# EasyEDA Pro project ProPrj_AUDIO CONTROLER_2026-01-01.epro, board PCB4
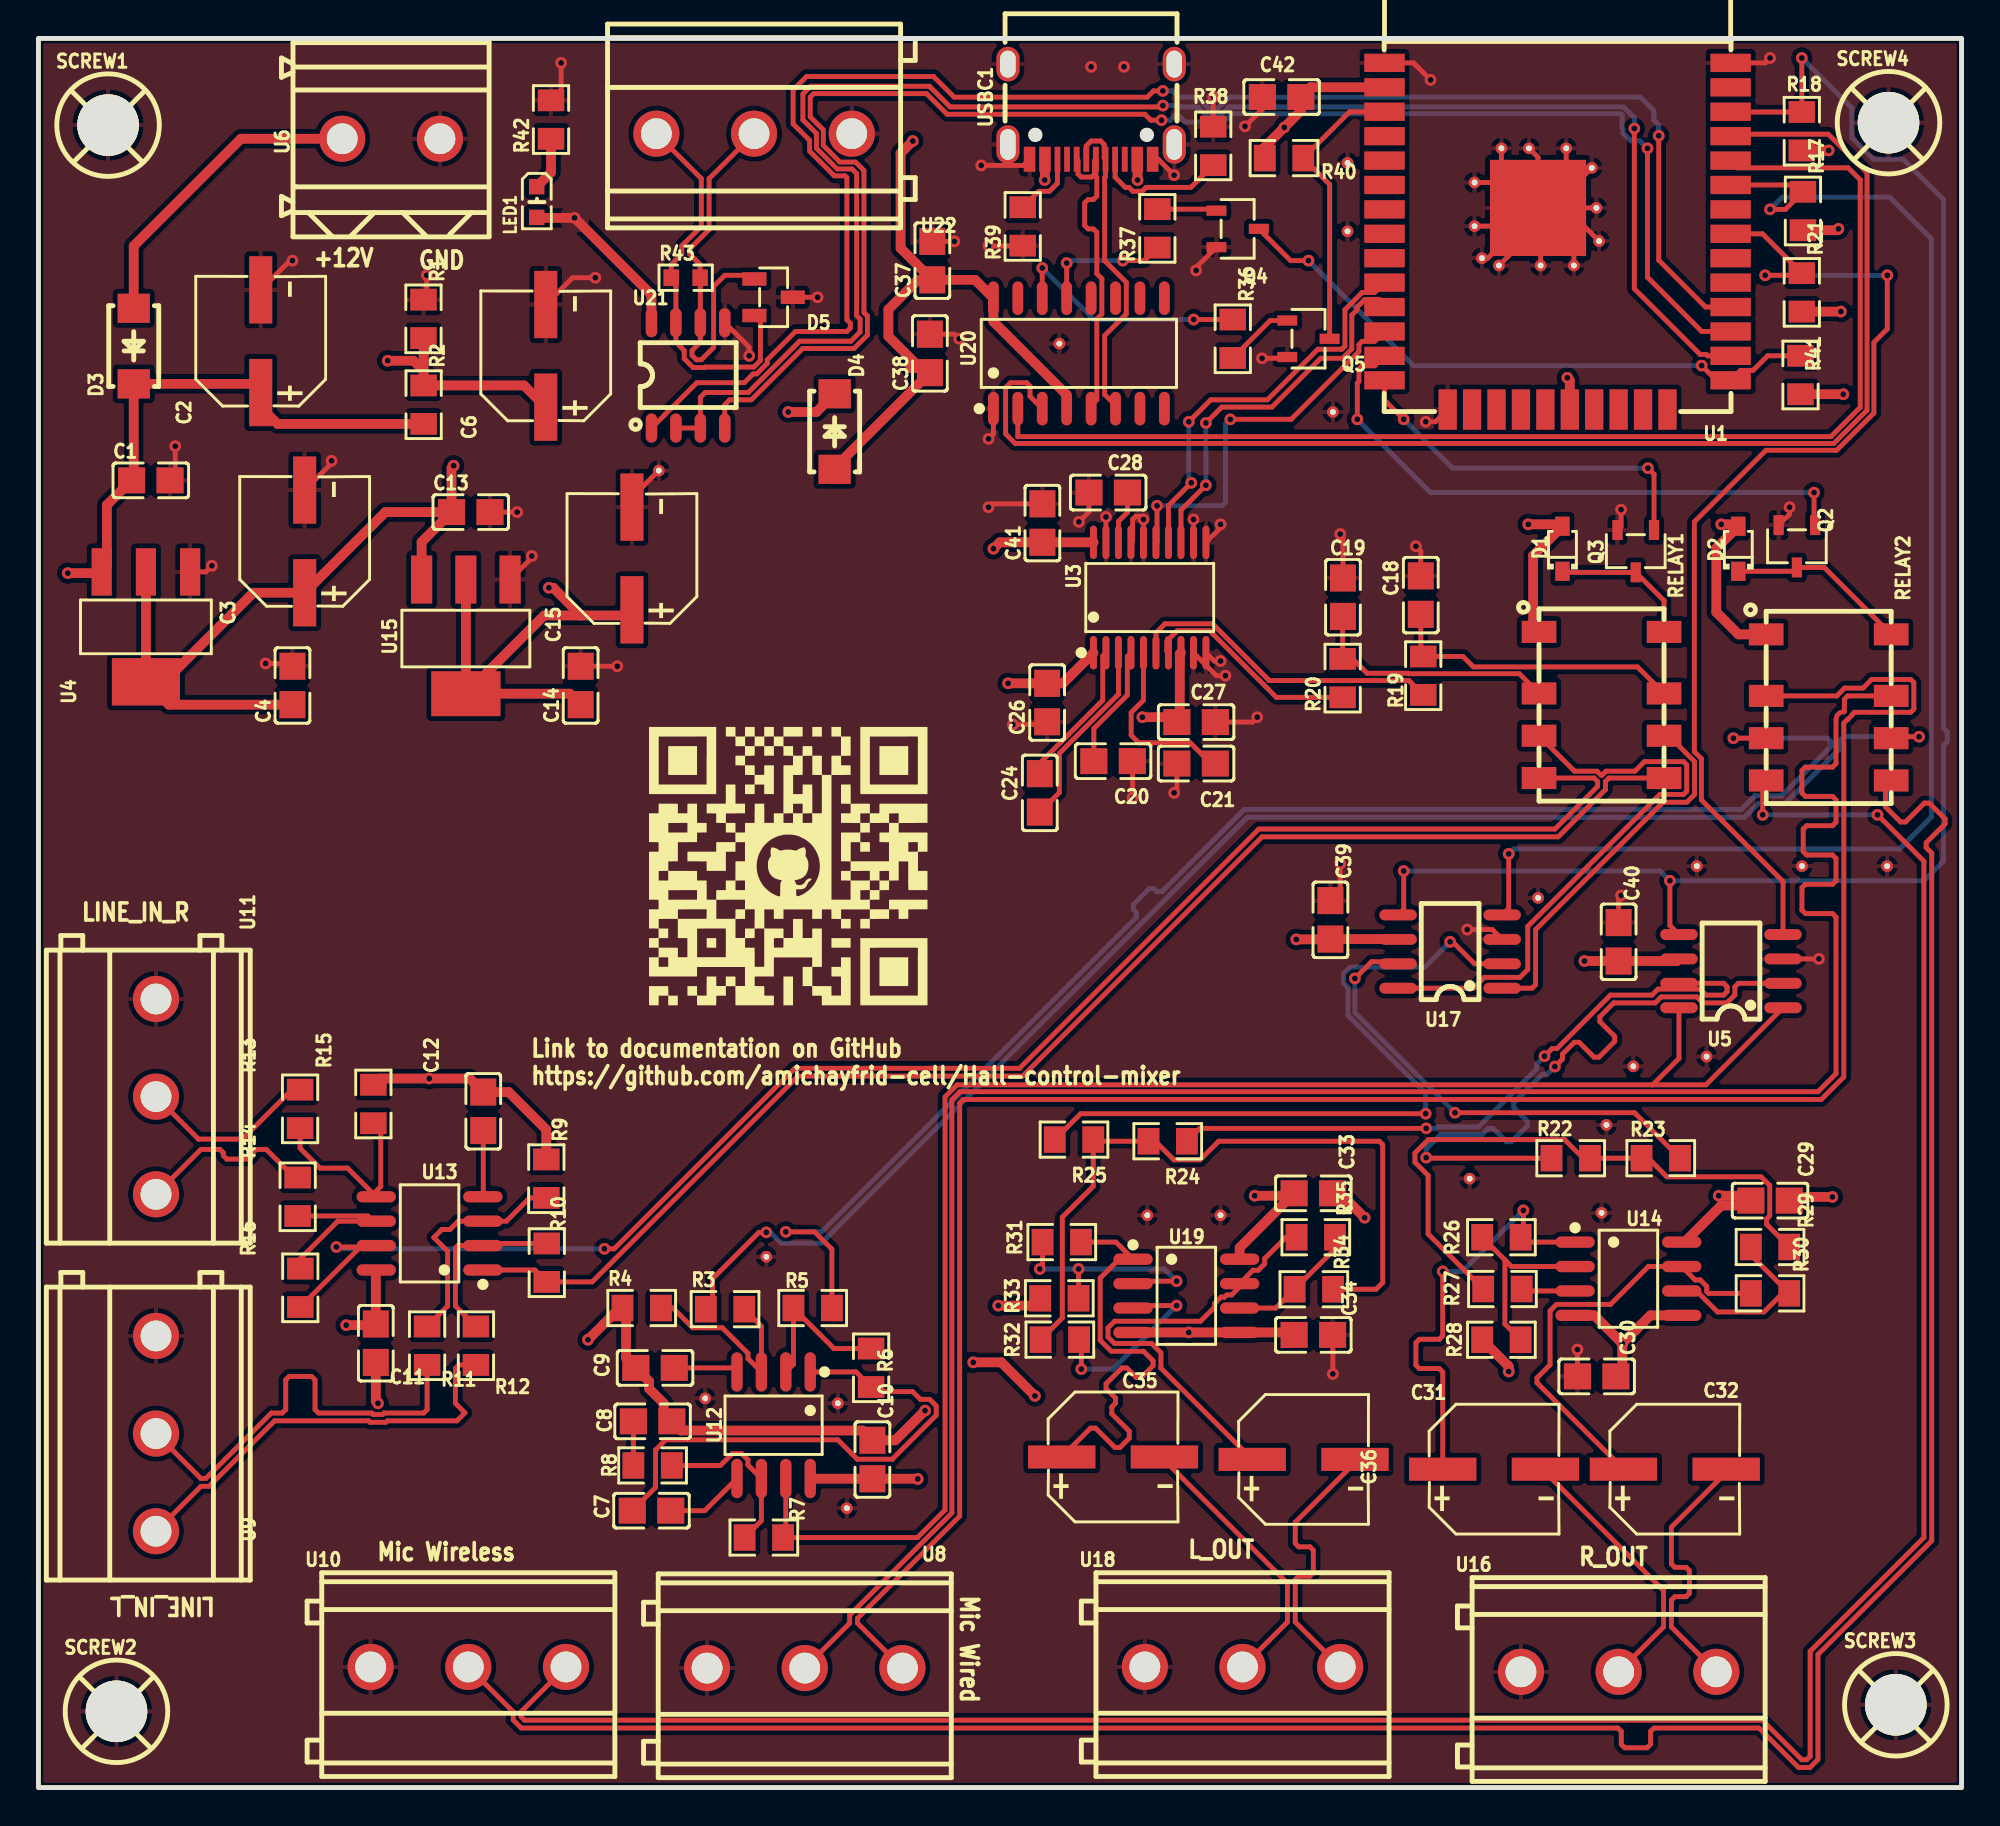
[diagram p1: board, top side]
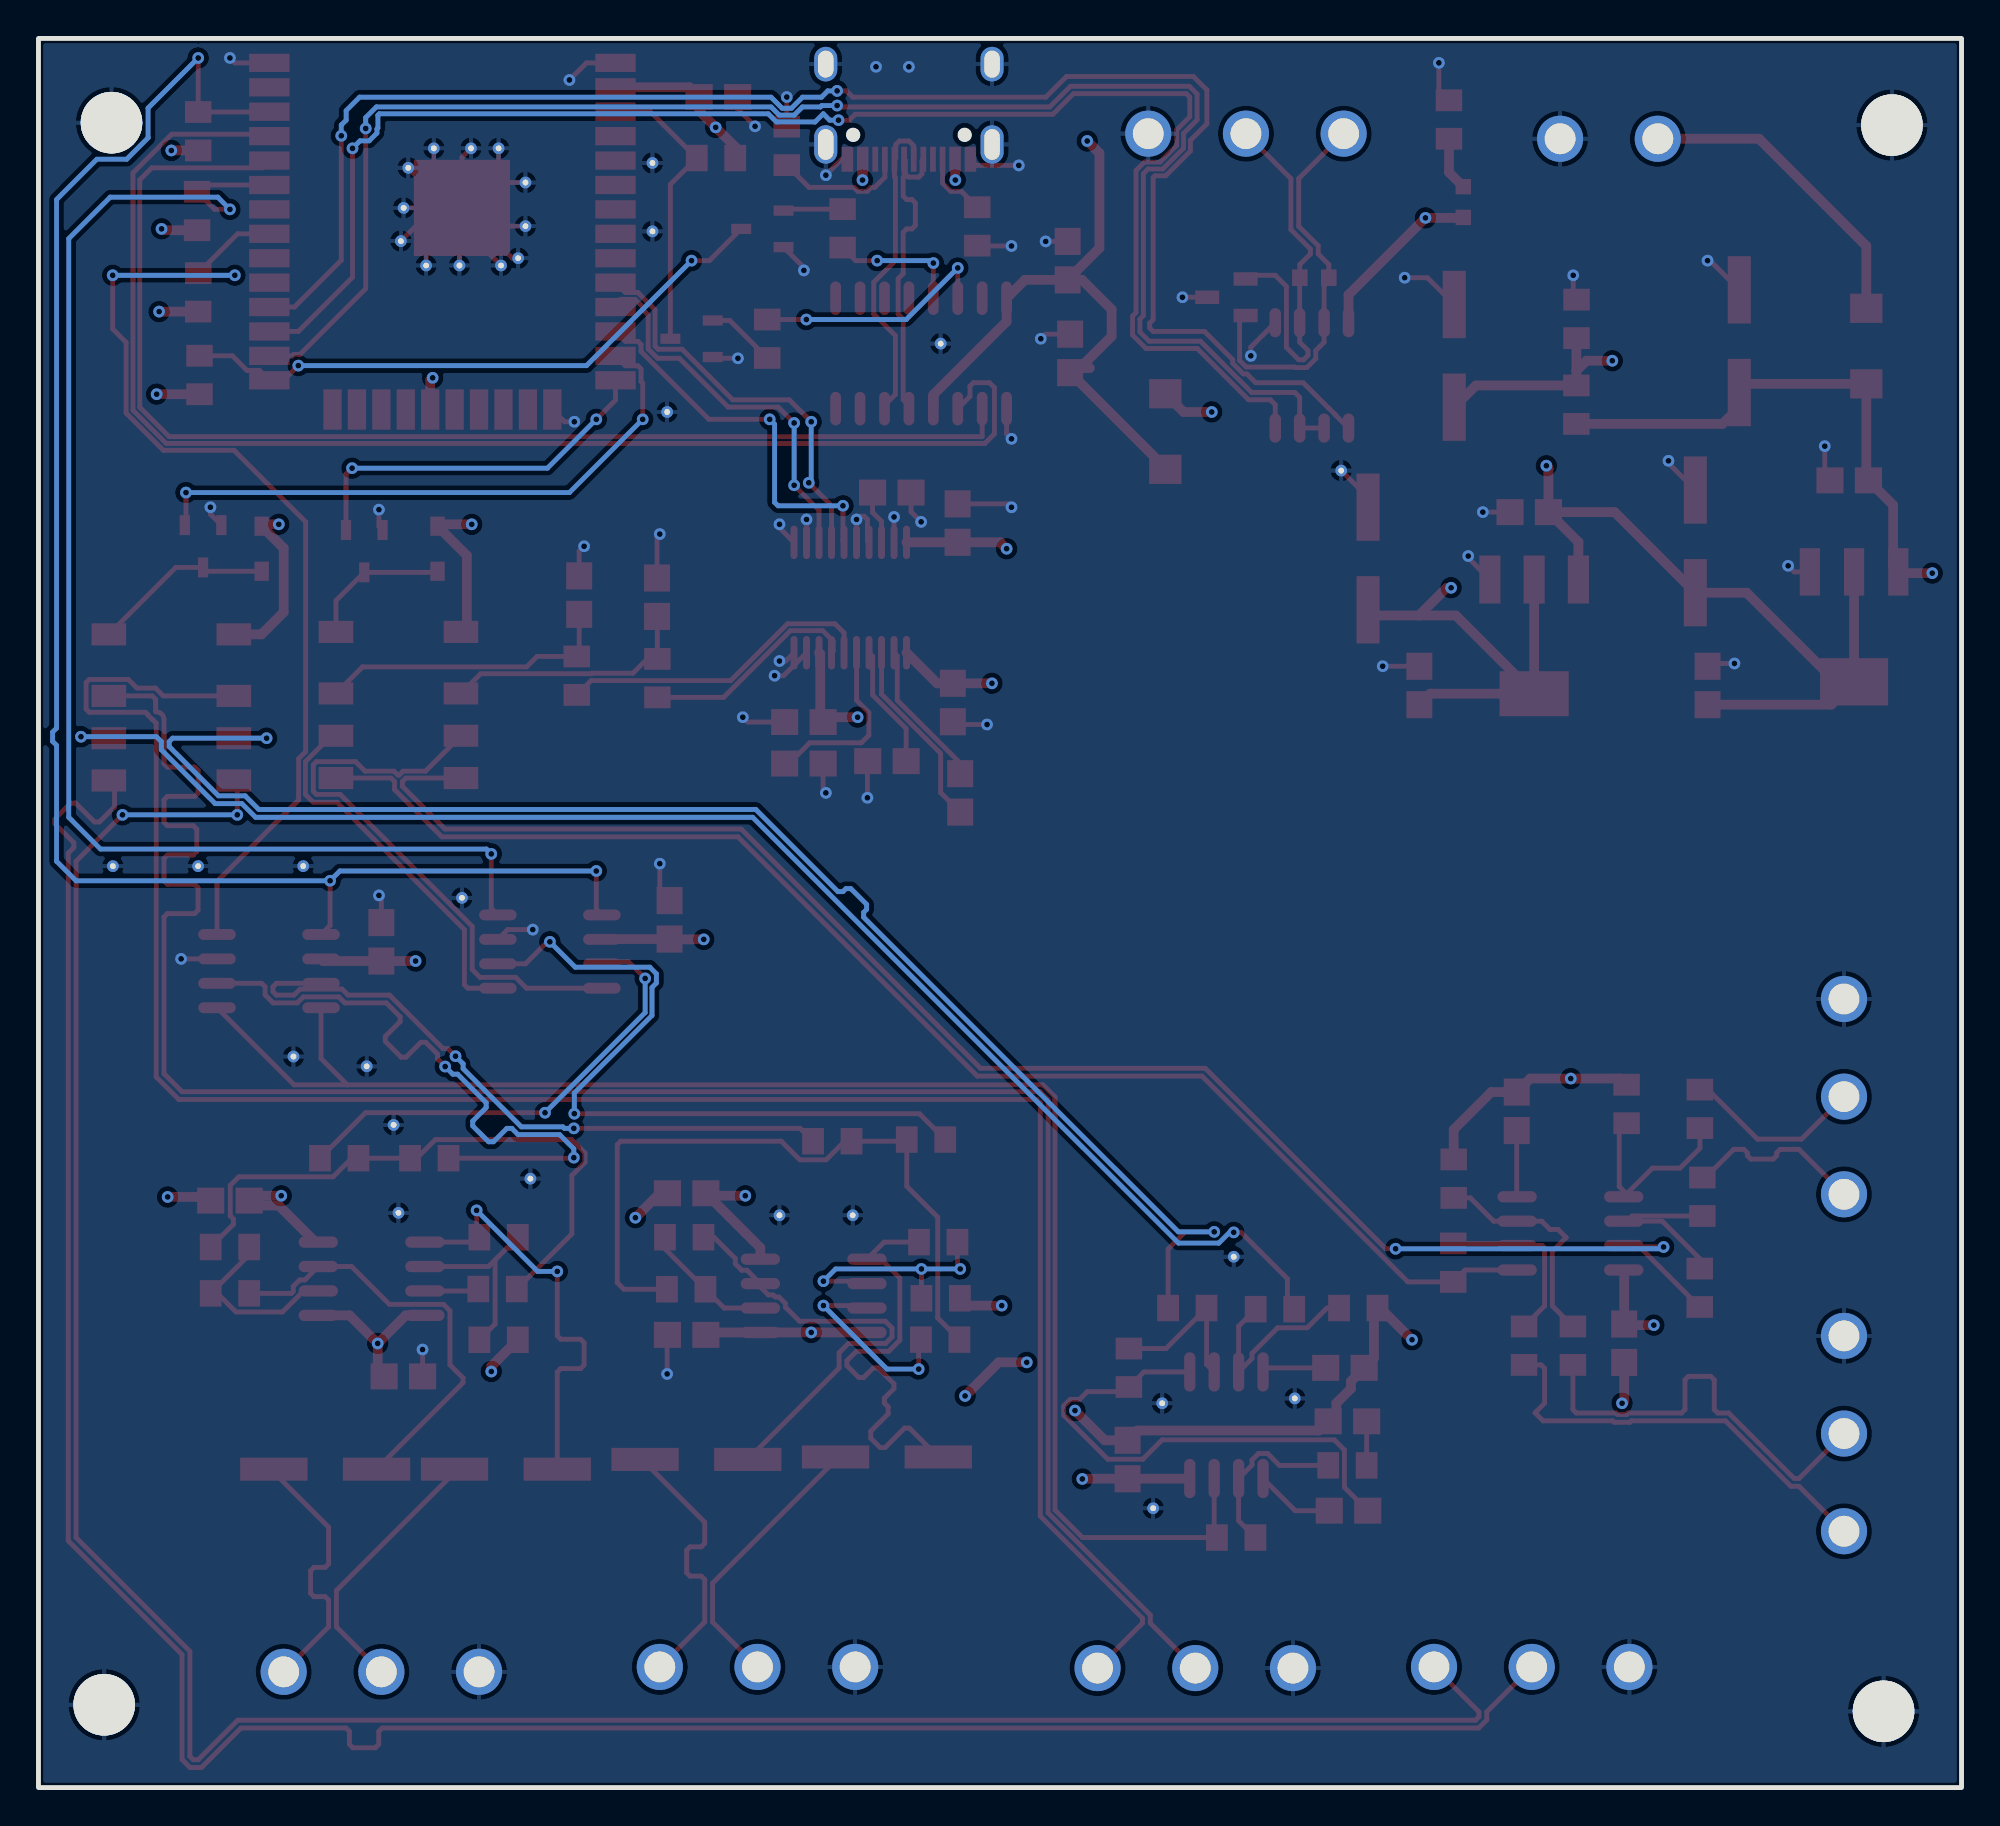
[diagram p2: board, bottom side, seen from below]

Outline 100 x 90.98 mm; copper layers: Top Layer, GND, Inner2, Bottom Layer. Coordinates in mm from the lower left corner of the outline.
Outline path: rectangle 0,90.98 100,0
Stack: Top Layer 0.035mm Outer layer thickness 1oz / Dielectric1 0.2104mm 7628 RC49% 8.6mil / GND 0.0152mm Inner layer thickness / Dielectric2 1.065mm 1.1mm H/HOZ Copper / Inner2 0.0152mm Inner layer thickness / Dielectric3 0.2104mm 7628 RC49% 8.6mil / Bottom Layer 0.035mm Outer layer thickness 1oz

## Design rules (mm)
net XLR_OUT_R_HOT: DP2
net $1N12984: DP3
net XLR_OUT_R_COLD: DP2
net $1N13611: DP5
net XLR_OUT_L_HOT: DP4
net $1N13634: DP5
net XLR_OUT_L_COLD: DP4
net $1N5833: DP12
net $1N6045: DP11
net $1N6056: DP11
net LINE_IN_L: DP14
net $1N6041: DP8
net $1N6052: DP8
net $1N6309: DP10
net $1N6179: DP9
net $1N6300: DP10
net $1N6296: DP9
net LINE_IN_R: DP14
net MIC_VOL_OUT_R: DP13
net MIC_VOL_OUT_L: DP13
net MIX_L_MUSIC: DP15
net MIX_R_MUSIC: DP15
net $1N5727: DP6
net $1N5749: DP7
net $1N5761: DP6
net USB_DP: DP1
net USB_DN: DP1
net $1N40597: DP12
net $1N40603: DP7
net C31: DP3
net B: DP17
net A: DP17
template: JLCPCB Capability(Two Layers Board)
spacing copperThickness1oz (default): track to track 0.102, other pairs 0.152 to 0.3
spacing copperThickness2oz: track to track 0.203, other pairs 0.152 to 0.3
track width copperThickness1oz (default): min 0.127, default 0.254, max 2.54
track width copperThickness2oz: min 0.203, default 0.254, max 2.54
differential pair differentialPair (default): width min 0.127, default 0.254, max 2.54; gap min 0.152, default 0.152
via viaSize (default): diameter min 0.5, default 0.61, max 10; hole min 0.3, default 0.305, max 6.3

## Placement (name value [footprint] x y rotation side)
C1  100nF  [C0805]  5.84 68 0 top
C2  47uF  [CAP-SMD_BD6.3-L6.6-W6.6-LS7.6-FD]  11.56 75.23 90 top
C3  47uF  [CAP-SMD_BD6.3-L6.6-W6.6-LS7.6-FD]  13.84 64.82 90 top
C4  100nF  [C0805]  13.21 57.33 90 top
C6  47uF  [CAP-SMD_BD6.3-L6.6-W6.6-LS7.6-FD]  26.38 74.47 90 top
C7  10uF  [C0805]  31.88 14.4 0 top
C8  10uF  [C0805]  31.94 19.05 0 top
C9  100nF  [C0805]  32.06 21.83 0 top
C10  100nF  [C0805]  43.37 17.06 270 top
C11  100nF  [C0805]  17.54 23.11 90 top
C12  100nF  [C0805]  23.13 35.18 90 top
C13  100nF  [C0805]  22.48 66.34 0 top
C14  100nF  [C0805]  28.19 57.33 90 top
C15  47uF  [CAP-SMD_BD6.3-L6.6-W6.6-LS7.6-FD]  30.86 63.93 90 top
C18  100nF  [C0805]  71.88 62.03 270 top
C19  100nF  [C0805]  67.83 61.92 270 top
C20  100nF  [C0805]  55.88 53.39 180 top
C21  100nF  [C0805]  60.2 53.26 0 top
C24  100nF  [C0805]  52.07 51.74 90 top
C26  100nF  [C0805]  52.45 56.44 270 top
C27  100nF  [C0805]  60.2 55.42 180 top
C28  10uF  [C0805]  55.63 67.36 180 top
C29  100nF  [C0805]  90.04 30.53 0 top
C30  100nF  [C0805]  81.03 21.39 0 top
C31  47uF  [CAP-SMD_BD6.3-L6.6-W6.6-LS7.6-FD]  75.69 16.56 0 top
C32  47uF  [CAP-SMD_BD6.3-L6.6-W6.6-LS7.6-FD]  85.09 16.56 0 top
C33  100nF  [C0805]  66.29 30.91 0 top
C34  100nF  [C0805]  66.29 23.55 180 top
C35  47uF  [CAP-SMD_BD6.3-L6.6-W6.6-LS7.6-FD]  55.88 17.2 0 top
C36  47uF  [CAP-SMD_BD6.3-L6.6-W6.6-LS7.6-FD]  65.79 17.07 0 top
C37  100nF  [C0805]  46.48 79.43 90 top
C38  100nF  [C0805]  46.36 74.6 90 top
C39  100nF  [C0805]  67.18 45.14 270 top
C40  100nF  [C0805]  82.17 43.99 270 top
C41  10uF  [C0805]  52.2 65.77 90 top
C42  10uF  [C0805]  64.64 87.94 180 top
D1  1N4148WS  [SOD-323_L1.8-W1.3-LS2.5-RD]  79.25 64.44 90 top
D2  1N4148WS  [SOD-323_L1.8-W1.3-LS2.5-RD]  88.39 64.44 90 top
D3  SS14  [SMA_L4.2-W2.6-LS5.0-RD_1]  4.95 74.98 90 top
D4  SS14  [SMA_L4.2-W2.6-LS5.0-RD_1]  41.4 70.54 270 top
D5  SM712  [SOT-23-3_L2.9-W1.3-P1.90-LS2.4-BR]  38.23 77.52 180 top
LED1  KT-0603W  [LED0603-R-RD_WHITE]  25.91 82.47 270 top
NOREF  -  [Pad_e1952]  68.07 84.51 0 top
NOREF#2  -  [Pad_e2417]  67.31 71.55 0 top
NOREF#3  -  [Pad_e1957]  34.67 20.24 0 top
NOREF#4  -  [Pad_e1945]  74.42 31.67 0 top
NOREF#5  -  [Pad_e1072]  75.06 79.55 0 top
NOREF#6  -  [Pad_e1949]  77.98 46.28 0 top
NOREF#7  -  [Pad_e1485]  96.13 47.93 0 top
NOREF#8  -  [Pad_e1060]  77.51 85.27 0 top
NOREF#9  -  [Pad_e1062]  75.95 79.17 0 top
NOREF#10  -  [Pad_e1484]  91.7 47.93 0 top
NOREF#11  -  [Pad_e1063]  78.11 79.17 0 top
NOREF#12  -  [Pad_e821]  32.26 68.5 0 top
NOREF#13  -  [Pad_e1030]  76.07 85.27 0 top
NOREF#14  -  [Pad_e1947]  82.93 37.52 0 top
NOREF#15  -  [Pad_e1950]  53.09 75.11 0 top
NOREF#16  -  [Pad_e1942]  61.47 29.77 0 top
NOREF#17  -  [Pad_e1064]  79.84 79.17 0 top
NOREF#18  -  [Pad_e1958]  37.85 27.61 0 top
NOREF#19  -  [Pad_e1943]  57.66 29.77 0 top
NOREF#20  -  [Pad_e1065]  81.01 82.17 0 top
NOREF#21  -  [Pad_e1951]  68.07 80.95 0 top
NOREF#22  -  [Pad_e1061]  79.44 85.27 0 top
NOREF#23  -  [Pad_e1946]  81.53 34.47 0 top
NOREF#24  -  [Pad_e1941]  81.28 29.9 0 top
NOREF#25  -  [Pad_e1070]  74.68 83.49 0 top
NOREF#26  -  [Pad_e1071]  74.68 81.22 0 top
NOREF#27  -  [Pad_e1948]  86.74 38.02 0 top
NOREF#28  -  [Pad_e1956]  41.57 19.99 0 top
NOREF#29  -  [Pad_e1955]  42.04 14.53 0 top
NOREF#30  -  [Pad_e1483]  86.23 47.93 0 top
NOREF#31  -  [Pad_e1069]  80.77 84.25 0 top
NOREF#32  -  [Pad_e1066]  81.15 80.44 0 top
Q2  MMBT3904  [SOT-23-3_L3.0-W1.7-P0.95-LS2.9-BR]  91.44 64.57 90 top
Q3  MMBT3904  [SOT-23-3_L3.0-W1.7-P0.95-LS2.9-BR]  83.06 64.31 90 top
Q4  S8050 J3Y(RANGE:200-350)  [SOT-23-3_L3.0-W1.7-P0.95-LS2.9-BR]  62.36 81.08 180 top
Q5  S8050 J3Y(RANGE:200-350)  [SOT-23-3_L3.0-W1.7-P0.95-LS2.9-BR]  66.04 75.36 180 top
R1  10kΩ  [R0805]  20.02 76.4 270 top
R2  10kΩ  [R0805]  20.03 71.93 270 top
R3  10kΩ  [R0805]  35.7 24.88 0 top
R4  10kΩ  [R0805]  31.37 24.94 0 top
R5  10kΩ  [R0805]  40.26 24.94 180 top
R6  10kΩ  [R0805]  43.3 21.84 90 top
R7  100kΩ  [R0805]  37.72 13 0 top
R8  4.7kΩ  [R0805]  31.94 16.76 180 top
R9  10kΩ  [R0805]  26.41 31.67 270 top
R10  10kΩ  [R0805]  26.43 27.3 90 top
R11  10kΩ  [R0805]  20.21 22.98 90 top
R12  10kΩ  [R0805]  22.75 22.98 90 top
R13  10kΩ  [R0805]  13.61 35.3 270 top
R14  10kΩ  [R0805]  13.48 30.73 270 top
R15  10kΩ  [R0805]  17.42 35.56 90 top
R16  10kΩ  [R0805]  13.61 26 90 top
R17  4.7kΩ  [R0805]  91.75 82.01 270 top
R18  4.7kΩ  [R0805]  91.69 86.16 270 top
R19  470Ω  [R0805]  72.01 57.84 90 top
R20  470Ω  [R0805]  67.82 57.71 90 top
R21  4.7kΩ  [R0805]  91.69 77.77 270 top
R22  4.7kΩ  [R0805]  79.68 32.74 0 top
R23  4.7kΩ  [R0805]  84.36 32.74 180 top
R24  4.7kΩ  [R0805]  58.72 33.62 180 top
R25  4.7kΩ  [R0805]  53.85 33.71 180 top
R26  10kΩ  [R0805]  76.07 28.63 0 top
R27  10kΩ  [R0805]  76.13 25.93 0 top
R28  10kΩ  [R0805]  76.07 23.29 0 top
R29  10kΩ  [R0805]  90.04 28.12 180 top
R30  10kΩ  [R0805]  90.04 25.7 180 top
R31  10kΩ  [R0805]  53.21 28.37 0 top
R32  10kΩ  [R0805]  53.11 23.3 0 top
R33  10kΩ  [R0805]  53.09 25.45 0 top
R34  10kΩ  [R0805]  66.32 25.92 180 top
R35  10kΩ  [R0805]  66.42 28.63 180 top
R36  1kΩ  [R0805]  62.1 75.36 270 top
R37  1kΩ  [R0805]  58.18 81.1 90 top
R38  4.7kΩ  [R0805]  61.09 85.39 270 top
R39  4.7kΩ  [R0805]  51.18 81.2 90 top
R40  10kΩ  [R0805]  64.77 84.76 180 top
R41  10kΩ  [R0805]  91.63 73.48 90 top
R42  1kΩ  [R0805]  26.65 86.76 90 top
R43  120Ω  [R0603]  33.65 78.54 0 top
RELAY1  MUSIC_RELAY  [RELAY-SMD_HFD4-5-SR]  81.28 56.31 270 top
RELAY2  MIC RELAY  [RELAY-SMD_HFD4-5-SR]  93.09 56.18 270 top
SCREW1  -  [Screw-Hole-M3]  3.68 86.41 0 top
SCREW2  -  [Screw-Hole-M3]  4.12 3.9 0 top
SCREW3  -  [Screw-Hole-M3]  96.65 4.24 0 top
SCREW4  -  [Screw-Hole-M3]  96.27 86.54 0 top
U1  ESP32-WROOM-32D-N4  [WIFIM-SMD_39P-L25.5-W18.0-P1.27-BL]  78.99 80.7 270 top
U3  BT_DAC  [TSSOP-20_L6.5-W4.4-P0.65-LS6.4-BL]  57.79 61.9 0 top
U4  5V  [SOT-223_L6.5-W3.5-P2.30-LS7.0-BR]  5.59 60.38 90 top
U5  MICֹ_VOL  [SOIC-8_L5.0-W4.0-P1.27-LS6.0-BL]  88.01 42.47 90 top
U6  POWER_IN  [CONN-TH_2P-P5.08_DB128L-5.08-2P]  18.34 85.76 0 top
U8  Mic Wired  [CONN-TH_3P-P5.08_KF129-5.08-3P]  39.85 6.22 0 top
U9  LINEֹֹ_IN_L  [CONN-TH_3P-P5.08_KF129-5.08-3P]  6.11 18.41 270 top
U10  Mic Wireless  [CONN-TH_3P-P5.08_KF129-5.08-3P]  22.35 6.27 0 top
U11  LINE_IN_R  [CONN-TH_3P-P5.08_KF129-5.08-3P]  6.11 35.94 270 top
U12  MIC_AMP  [SOIC-8_L4.9-W3.9-P1.27-LS6.0-BL]  38.23 18.85 180 top
U13  LINEֹֹ_IN_L  [SOIC-8_L4.9-W3.9-P1.27-LS6.0-BL]  20.34 28.83 90 top
U14  OUT_R  [SOIC-8_L4.9-W3.9-P1.27-LS6.0-BL]  82.68 26.47 270 top
U15  3V  [SOT-223-3_L6.5-W3.4-P2.30-LS7.0-BR]  22.22 59.87 90 top
U16  R_OUT  [CONN-TH_3P-P5.08_KF129-5.08-3P]  82.17 6.02 0 top
U17  MUSIC_VOL  [SOIC-8_L5.0-W4.0-P1.27-LS6.0-BL]  73.41 43.48 90 top
U18  L_OUT  [CONN-TH_3P-P5.08_KF129-5.08-3P]  62.61 6.27 0 top
U19  OUT_L  [SOIC-8_L4.9-W3.9-P1.27-LS6.0-BL]  59.69 25.58 270 top
U20  USB  [SOP-16_L10.0-W3.9-P1.27-LS6.0-BL]  54.1 74.6 0 top
U21  SSP3485  [SOP-8_L5.0-W3.9-P1.27-LS6.0-BL]  33.78 73.46 0 top
U22  rs485  [CONN-TH_3P-P5.08_KF129-5.08-3P]  37.21 86.03 180 top
USBC1  TYPE-C-31-M-12  [USB-C_SMD-TYPE-C-31-M-12_1]  54.74 87.17 180 top

## Footprints (pads in the part's own frame, mm; a bottom-side part is the same pattern mirrored in y, then rotated)
C0805
  rect 1.41x1.35 smd: 1(-1,0) 2(1,0)
CAP-SMD_BD6.3-L6.6-W6.6-LS7.6-FD
  rect 3.5x1.2 smd: 1(-2.67,0) 2(2.67,0)
CONN-TH_2P-P5.08_DB128L-5.08-2P
  round 2.4 hole 1.6: 1(-2.54,0) 2(2.54,0)
CONN-TH_3P-P5.08_KF129-5.08-3P
  round 2.4 hole 1.6: 1(-5.08,0) 2(0,0) 3(5.08,0)
LED0603-R-RD_WHITE
  rect 0.8x0.8 smd: 1(0.8,0) 2(-0.8,0)
Pad_e821
  round 0.61 hole 0.305: 1(0,0)
Pad_e1030
  round 0.61 hole 0.305: 1(0,0)
Pad_e1060
  round 0.61 hole 0.305: 2(0,0)
Pad_e1061
  round 0.61 hole 0.305: 3(0,0)
Pad_e1062
  round 0.61 hole 0.305: 4(0,0)
Pad_e1063
  round 0.61 hole 0.305: 5(0,0)
Pad_e1064
  round 0.61 hole 0.305: 6(0,0)
Pad_e1065
  round 0.61 hole 0.305: 7(0,0)
Pad_e1066
  round 0.61 hole 0.305: 8(0,0)
Pad_e1069
  round 0.61 hole 0.305: 9(0,0)
Pad_e1070
  round 0.61 hole 0.305: 10(0,0)
Pad_e1071
  round 0.61 hole 0.305: 11(0,0)
Pad_e1072
  round 0.61 hole 0.305: 12(0,0)
Pad_e1483
  round 0.61 hole 0.305: 1(0,0)
Pad_e1484
  round 0.61 hole 0.305: 2(0,0)
Pad_e1485
  round 0.61 hole 0.305: 3(0,0)
Pad_e1941
  round 0.61 hole 0.305: 1(0,0)
Pad_e1942
  round 0.61 hole 0.305: 2(0,0)
Pad_e1943
  round 0.61 hole 0.305: 3(0,0)
Pad_e1945
  round 0.61 hole 0.305: 1(0,0)
Pad_e1946
  round 0.61 hole 0.305: 2(0,0)
Pad_e1947
  round 0.61 hole 0.305: 3(0,0)
Pad_e1948
  round 0.61 hole 0.305: 4(0,0)
Pad_e1949
  round 0.61 hole 0.305: 5(0,0)
Pad_e1950
  round 0.61 hole 0.305: 6(0,0)
Pad_e1951
  round 0.61 hole 0.305: 7(0,0)
Pad_e1952
  round 0.61 hole 0.305: 8(0,0)
Pad_e1955
  round 0.61 hole 0.305: 1(0,0)
Pad_e1956
  round 0.61 hole 0.305: 2(0,0)
Pad_e1957
  round 0.61 hole 0.305: 3(0,0)
Pad_e1958
  round 0.61 hole 0.305: 4(0,0)
Pad_e2417
  round 0.61 hole 0.305: 1(0,0)
R0603
  rect 0.806x0.864 smd: 1(-0.753,0) 2(0.753,0)
R0805
  rect 1.133x1.377 smd: 1(-1,0) 2(1,0)
RELAY-SMD_HFD4-5-SR
  rect 1.15x1.8 smd: 1(-3.8,-3.25) 2(-0.6,-3.25) 3(1.6,-3.25) 4(3.8,-3.25) 5(3.8,3.25) 6(1.6,3.25) 7(-0.6,3.25) 8(-3.8,3.25)
Screw-Hole-M3
  round 3.2 hole 3.2: 1(-0.064,0.064)
SMA_L4.2-W2.6-LS5.0-RD_1
  rect 1.52x1.68 smd: 1(-1.965,0) 2(1.965,0)
SOD-323_L1.8-W1.3-LS2.5-RD
  rect 1x0.75 smd: 1(-1.173,0) 2(1.173,0)
SOIC-8_L4.9-W3.9-P1.27-LS6.0-BL
  oval 0.588x2.045 smd: 1(-1.905,-2.772) 2(-0.635,-2.772) 3(0.635,-2.772) 4(1.905,-2.772) 5(1.905,2.772) 6(0.635,2.772) 7(-0.635,2.772) 8(-1.905,2.772)
SOIC-8_L5.0-W4.0-P1.27-LS6.0-BL
  oval 0.569x1.95 smd: 1(-1.905,-2.705) 2(-0.635,-2.705) 3(0.635,-2.705) 4(1.905,-2.705) 5(1.905,2.705) 6(0.635,2.705) 7(-0.635,2.705) 8(-1.905,2.705)
SOP-8_L5.0-W3.9-P1.27-LS6.0-BL
  oval 0.6x1.52 smd: 1(-1.905,-2.74) 2(-0.635,-2.74) 3(0.635,-2.74) 4(1.905,-2.74) 5(1.905,2.74) 6(0.635,2.74) 7(-0.635,2.74) 8(-1.905,2.74)
SOP-16_L10.0-W3.9-P1.27-LS6.0-BL
  oval 0.56x1.745 smd: 1(-4.445,-2.873) 2(-3.175,-2.873) 3(-1.905,-2.873) 4(-0.635,-2.873) 5(0.635,-2.873) 6(1.905,-2.873) 7(3.175,-2.873) 8(4.445,-2.873) 9(4.445,2.873) 10(3.175,2.873) 11(1.905,2.873) 12(0.635,2.873) 13(-0.635,2.873) 14(-1.905,2.873) 15(-3.175,2.873) 16(-4.445,2.873)
SOT-23-3_L2.9-W1.3-P1.90-LS2.4-BR
  rect 1.25x0.7 smd: 1(1,-0.95) 2(1,0.95) 3(-1,0)
SOT-23-3_L3.0-W1.7-P0.95-LS2.9-BR
  rect 1.038x0.532 smd: 1(1.101,-0.95) 2(1.101,0.95) 3(-1.101,0)
SOT-223-3_L6.5-W3.4-P2.30-LS7.0-BR
  rect 2.5x1.1 smd: 1(2.97,-2.3) 2(2.97,0) 3(2.97,2.3)
  rect 2.34x3.6 smd: 4(-2.97,0)
SOT-223_L6.5-W3.5-P2.30-LS7.0-BR
  rect 2.465x1.05 smd: 1(2.857,-2.3) 2(2.857,0) 3(2.857,2.3)
  rect 2.465x3.54 smd: 4(-2.857,0)
TSSOP-20_L6.5-W4.4-P0.65-LS6.4-BL
  oval 0.364x1.742 smd: 1(-2.925,-2.871) 2(-2.275,-2.871) 3(-1.625,-2.871) 4(-0.975,-2.871) 5(-0.325,-2.871) 6(0.325,-2.871) 7(0.975,-2.871) 8(1.625,-2.871) 9(2.275,-2.871) 10(2.925,-2.871) 11(2.925,2.871) 12(2.275,2.871) 13(1.625,2.871) 14(0.975,2.871) 15(0.325,2.871) 16(-0.325,2.871) 17(-0.975,2.871) 18(-1.625,2.871) 19(-2.275,2.871) 20(-2.925,2.871)
USB-C_SMD-TYPE-C-31-M-12_1
  oval 1.2x2 hole 0.8x1.6: 1(4.325,1.706) 4(-4.325,1.706)
  oval 1.2x1.8 hole 0.8x1.4: 2(4.325,-2.474) 3(-4.325,-2.474)
  custom 0.6x1.3 smd: A1B12(-3.2,2.474) A4B9(-2.4,2.474) B1A12(3.2,2.474) B4A9(2.401,2.474)
  rect 0.3x1.3 smd: A5(-1.25,2.474) A6(-0.25,2.474) A7(0.25,2.474) A8(1.25,2.474) B5(1.75,2.474) B6(0.75,2.474) B7(-0.75,2.474) B8(-1.75,2.474)
WIFIM-SMD_39P-L25.5-W18.0-P1.27-BL
  rect 0.95x2.1 smd: 1(-9.015,-9) 2(-7.745,-9) 3(-6.475,-9) 4(-5.205,-9) 5(-3.935,-9) 6(-2.665,-9) 7(-1.395,-9) 8(-0.125,-9) 9(1.145,-9) 10(2.415,-9) 11(3.685,-9) 12(4.955,-9) 13(6.225,-9) 14(7.495,-9) 25(7.495,9) 26(6.225,9) 27(4.955,9) 28(3.685,9) 29(2.415,9) 30(1.145,9) 31(-0.125,9) 32(-1.395,9) 33(-2.665,9) 34(-3.935,9) 35(-5.205,9) 36(-6.475,9) 37(-7.745,9) 38(-9.015,9)
  rect 2.1x0.95 smd: 15(9.015,-5.715) 16(9.015,-4.445) 17(9.015,-3.175) 18(9.015,-1.905) 19(9.015,-0.635) 20(9.015,0.635) 21(9.015,1.905) 22(9.015,3.175) 23(9.015,4.445) 24(9.015,5.715)
  rect 5x5 smd: 39(-1.472,-1.017)

## Nets
As in the schematic, except:
GND: C1.2 C2.2 C3.2 C4.2 C6.2 C13.2 C14.2 C15.2 C18.1 C19.1 C20.1 C21.1 C26.2 C27.1 C28.2 C30.1 C34.1 C37.2 C38.2 C39.1 C40.1 C41.2 C42.2 D5.3 NOREF.8 NOREF#2.1 NOREF#3.3 NOREF#4.1 NOREF#5.12 NOREF#6.5 NOREF#7.3 NOREF#8.2 NOREF#9.4 NOREF#10.2 NOREF#11.5 NOREF#12.1 NOREF#13.1 NOREF#14.3 NOREF#15.6 NOREF#16.2 NOREF#17.6 NOREF#18.4 NOREF#19.3 NOREF#20.7 NOREF#21.7 NOREF#22.3 NOREF#23.2 NOREF#24.1 NOREF#25.10 NOREF#26.11 NOREF#27.4 NOREF#28.2 NOREF#29.1 NOREF#30.1 NOREF#31.9 NOREF#32.8 Q2.2 Q3.2 Q4.2 Q5.2 R1.1 R38.1 R39.1 R42.2 SCREW1.1 SCREW2.1 SCREW3.1 SCREW4.1 U1.1 U1.15 U1.38 U1.39 U3.9 U3.10 U3.11 U3.12 U3.16 U3.17 U3.19 U4.1 U5.3 U6.2 U8.1 U9.1 U10.1 U11.1 U15.1 U16.1 U17.3 U18.1 U20.1 U21.5 U22.1 USBC1.1 USBC1.2 USBC1.3 USBC1.4 USBC1.A1B12 USBC1.B1A12
A: D5.2 R43.1 U21.7 U22.3

Pads without a net: U1 4 5 6 7 8 9 16 17 18 19 21 22 23 24 29 30 32 37; U20 7 8 9 10 11 12 15; USBC1 A8 B8

## Via types
v1: diameter 0.61, hole 0.305, Top Layer to Bottom Layer, 140 vias

## Routing (per net, layer and track width the routed paths; a pad name or vN(x,y) marks a point on that pad's centre or on a via; arc(x,y) is an arc through that point)
+3V3: length 222.7
  Top Layer w0.508: v1(57.4,55.68) 58.94,55.68 C27.2 59.35,55.57 59.35,58.97 U3.8 ; 28.21,60.97 26.29,60.97 U15.4 ; 28.21,60.97 26.77,62.41 v1(26.54,62.41) ; 28.21,60.97 30.57,60.97 C15.1 ; v1(93.6,81.08) 93.53,81.01 R17.2 ; U15.2 U15.4 ; U15.4 27.62,56.9 C14.1 ; U21.8 31.88,77.65 v1(27.88,81.65) 25.93,81.65 LED1.1 ; R41.1 v1(93.85,72.48) ; U3.20 54.86,64.77 C41.1 49.99,64.77 v1(49.66,64.44) ; U1.20 79.63,73.2 v1(79.5,73.33) ; v1(50.42,57.44) C26.1 53.27,57.44 U3.1 ; R40.2 63.77,85.34 v1(64.79,86.36) 65.64,87.22 C42.1 66.15,88.44 69.99,88.44 U1.2 ; R18.2 v1(93.09,85.16) ; R21.2 v1(93.73,76.77)
  Inner2 w0.508: v1(79.5,73.33) 79.25,73.58
  Inner2 w0.762: v1(64.79,86.36) 60.08,81.65 ; 60.08,81.65 v1(27.88,81.65) 19.81,73.58 19.81,67.74 25.15,62.41 v1(26.54,62.41) 28.58,64.44 v1(49.66,64.44) 50.42,63.68 v1(50.42,57.44) 55.64,57.44 v1(57.4,55.68) ; 60.08,81.65 68.39,73.33 v1(79.5,73.33) 80.35,72.48 v1(93.85,72.48) 93.73,72.6 v1(93.73,76.77) 93.73,80.95 v1(93.6,81.08) 93.09,81.58 v1(93.09,85.16)
+5V: length 187
  Top Layer w0.508: RELAY1.1 77.72,60.42 77.72,64.09 D1.2 79.15,65.71 v1(77.47,65.71) ; RELAY2.1 88.4,59.98 87.25,61.14 87.25,64.47 D2.2 88.29,65.71 v1(87.5,65.71) ; C4.1 6.78,56.33 U4.4 ; v1(21.59,68.76) 21.48,68.65 C13.1 ; C13.1 18.04,66.34 C3.1 11.17,62.15 6.54,57.52 U4.4 ; C13.1 19.92,64.79 U15.3 ; v1(80.39,42.99) C40.2 85.2,42.99 U5.6 ; v1(38.99,71.55) 40.45,71.55 D4.1 ; U4.4 U4.2 ; 70.7,44.12 70.68,44.14 C39.2 67.17,44.12 v1(65.4,44.12)
  Inner2 w0.508: 49.28,68.66 49.28,69.28 48.69,69.86 40.68,69.86 v1(38.99,71.55) 36.2,68.76 33.01,68.76 32.55,69.21 31.96,69.21 31.51,68.76 v1(21.59,68.76) ; 49.28,68.66 74.52,68.66 v1(77.47,65.71) v1(87.5,65.71) ; 49.28,68.66 49.28,68.5 65.4,52.38 v1(65.4,44.12) 66.53,42.99 v1(80.39,42.99)
+12V: length 185.9
  Top Layer w0.508: v1(1.52,63.17) 3.22,63.17 U4.3 3.56,63.5 3.56,66.71 C1.1 4.95,68.11 D3.1 11.11,73.02 C2.1 11.56,71.81 12.43,70.93 R2.2 ; 65.17,30.78 C33.1 ; 65.17,30.78 62.46,28.08 U19.8 ; 65.17,30.78 v1(63.25,30.78) ; v1(16,24.05) 17.49,24.05 C11.2 17.54,26.9 17.56,26.92 ; v1(45.72,16.05) 45.71,16.06 C10.2 40.14,16.06 U12.8 ; U14.8 85.6,28.37 87.5,30.28 88.79,30.28 C29.1 88.79,30.78 v1(87.38,30.78)
  Inner2 w0.508: v1(87.38,30.78) v1(63.25,30.78) 60.45,30.78 v1(45.72,16.05) 41.4,11.73 21.34,11.73 16,17.07 v1(16,24.05) 15.11,24.05 7.72,31.45 7.72,31.52 5.29,33.95 5.12,33.95 1.14,37.93 1.14,62.79 v1(1.52,63.17)
GND: length 125.8
  Top Layer w0.254: U15.1 25.65,63.97 v1(25.65,64.06) ; v1(67.69,48.06) 67.69,46.64 C39.1 ; U1.39 77.98,84.8 NOREF#8.2 ; U1.39 79.44,83.63 NOREF#22.3 ; U1.39 76.65,83.49 ; U1.39 77.98,81.2 NOREF#9.4 ; v1(74.3,44.63) 75.6,44.63 76.11,44.12 ; C42.2 63.64,87.32 v1(62.74,86.41) ; C21.1 59.2,51.88 v1(59.05,51.74) ; v1(61.47,58.6) 61.14,58.6 U3.10 ; U4.1 8.7,63.23 v1(9.02,63.55) ; v1(67.69,65.2) 67.83,65.06 C19.1 ; v1(13.21,79.43) 13.08,79.43 C2.2 ; C26.2 52.31,55.3 v1(50.67,55.3) ; v1(61.72,57.84) 61.25,57.84 60.06,59.03 ; v1(47.88,75.36) 47.64,75.6 C38.2 ; C3.2 15.24,68.89 v1(15.24,69.01) ; NOREF#5.12 75.36,79.55 77.03,81.22 NOREF#26.11 ; v1(72.14,71.04) 72.64,71.04 U1.15 ; 82.11,65.41 82.3,65.6 v1(82.3,66.47) ; NOREF#17.6 79.84,80.3 78.11,82.03 NOREF#11.5 ; v1(49.4,80.19) 51.17,80.19 R39.1 ; v1(63.63,74.35) 64.87,74.35 Q5.2 ; v1(36.96,74.47) 36.96,74.93 U21.5 ; C15.2 30.86,67.11 NOREF#12.1 ; v1(90.04,89.97) 89.79,89.71 U1.38 ; NOREF#25.10 76.65,83.49 ; 76.65,83.49 76.07,84.07 NOREF#13.1 ; U3.19 v1(55.51,66.09) ; C28.2 54.63,66.36 v1(54.1,65.84) ; NOREF#32.8 79.43,82.17 78.69,82.17 ; v1(7.11,69.77) 7.11,68.27 C1.2 ; C4.2 13.06,58.47 v1(11.81,58.47) ; 60.06,64.77 v1(60.06,65.96) ; C41.2 49.58,66.77 v1(49.4,66.6) ; Q4.2 60.2,79.07 v1(60.2,78.92) ; v1(82.3,46.41) 82.17,46.28 C40.1 ; C6.2 27.77,78.54 v1(28.96,78.54) ; 78.69,82.17 NOREF#20.7 ; 78.69,82.17 NOREF#31.9 ; U3.17 56.9,64.86 56.9,65.96 57.06,66.13 57.3,66.13 v1(57.46,65.96) 57.46,64.77 ; USBC1.B1A12 51.22,84.38 v1(49.02,84.38) ; 90.72,43.1 v1(92.58,43.1) ; USBC1.A1B12 58.23,84.7 v1(59.05,83.87) ; C30.1 v1(80.03,22.78) ; C34.1 67.31,23.53 v1(67.31,21.51) ; v1(61.47,65.71) 61.47,65.53 U3.11 ; v1(63.37,55.68) 63.12,55.42 C27.1 ; C37.2 v1(47.62,80.43) ; v1(72.39,88.82) 71.5,89.71 U1.1 ; v1(27.18,89.71) 27.18,88.29 R42.2 ; C20.1 56.9,53.38 v1(56.9,51.49) ; v1(49.4,70.15) 49.66,70.41 U20.1 ; D5.3 v1(40.51,77.52) ; Q2.2 91.06,66.24 v1(91.06,66.6) ; v1(71.63,64.57) 71.88,64.31 C18.1 ; R1.1 20.19,77.57 v1(20.19,78.66) ; C14.2 v1(30.1,58.33) ; R38.1 v1(61.09,87.94) ; C13.2 v1(24.89,66.34)
  vias: v1(54.74,89.51) v1(56.45,89.51)
VBUS_5V: length 48.6
  Top Layer w0.508: C37.1 45.74,78.43 44.2,76.89 44.2,75.49 45.59,74.09 45.34,73.84 46.12,73.84 C38.1 41.4,68.65 D4.2 ; C37.1 44.83,80.08 44.83,85.01 v1(45.47,85.65) ; C37.1 48.7,78.43 U20.16 49.66,76.26 53.47,72.45 U20.4 ; v1(52.32,83.62) 52.34,83.63 USBC1.B4A9 ; USBC1.A4B9 57.15,84.69 v1(57.15,83.62)
  Inner2 w0.508: v1(45.47,85.65) 47.5,83.62 v1(52.32,83.62) v1(57.15,83.62)
A: length 20.4
  Top Layer w0.254: D5.2 37.54,76.26 37.54,74.23 37.2,73.89 34.66,73.89 34.64,73.86 34.05,73.86 33.58,74.33 33.58,74.75 33.15,75.18 U21.7 33.15,78.12 32.9,78.37 R43.1 32.9,79.22 33.45,79.77 33.45,80.2 34.47,81.21 34.47,83.69 U22.3
B: length 20.4
  Top Layer w0.254: U22.2 34.87,83.69 34.87,81.04 33.86,80.03 33.86,79.77 34.41,79.22 R43.2 34.42,78.53 U21.6 34.42,75.18 33.99,74.75 33.99,74.5 34.21,74.27 34.47,74.27 35.11,74.91 35.11,78.08 35.69,78.66 37.03,78.66 D5.1
BT_OUT_L: length 15.6
  Top Layer w0.254: RELAY1.7 83.15,58.29 74.61,58.29 74.07,58.84 R19.2 71.88,58.96 C18.2
BT_OUT_R: length 13.2
  Top Layer w0.254: RELAY1.2 77,57.94 71.26,57.94 71.23,57.96 69.09,57.96 68.34,58.71 R20.2 67.82,60.9 C19.2
C31: length 22.6
  Top Layer w0.254: v1(77.22,30.02) 77.22,28.77 R26.2 77.33,28.37 U14.1 ; v1(73.02,26.85) 73.02,23.5 72.84,23.32 71.81,23.32 71.63,23.14 71.63,21.97 71.81,21.79 72.84,21.79 73.02,21.61 C31.1
  Bottom Layer w0.254: v1(73.02,26.85) 74.04,26.85 v1(77.22,30.02)
DAC_OUT_L: length 16.7
  Top Layer w0.254: R19.1 71.26,57.58 64,57.58 61.05,60.53 58.58,60.53 58.11,60.07 U3.6
DAC_OUT_R: length 11.4
  Top Layer w0.254: U3.7 58.67,59.11 58.67,59.63 59.22,60.18 60.9,60.18 64.37,56.71 R20.1
DTR: length 6.9
  Top Layer w0.254: v1(56.39,79.43) 57.5,79.43 R37.1 ; v1(53.47,79.3) U20.13
  Bottom Layer w0.254: v1(53.47,79.3) 53.59,79.43 v1(56.39,79.43)
ESP_EN: length 15.2
  Top Layer w0.254: Q5.3 67.14,83.39 R40.1 68.18,87.17 69.99,87.17 69.99,87.17 U1.3
FINAL_MIX_L: length 37.4
  Top Layer w0.254: R32.1 53.24,24.43 53.24,29.67 54.85,31.28 R25.1 54.93,33.62 R24.2 58.07,33.62 59.04,32.65 60.4,32.65 61.37,33.62 69.72,33.62 69.9,33.44 69.9,26.27 69.56,25.92 R34.1
FINAL_MIX_R: length 32
  Top Layer w0.254: R29.1 89.86,29.3 89.86,29.58 90.03,29.74 90.03,31.32 89.58,31.77 84.68,31.77 83.71,32.74 R23.2 R22.2 80.33,32.74 79.36,33.7 72.27,33.7 71.58,33.01 71.58,32.52 72.26,31.84 72.26,28.8 R27.1
GPIO_0: length 32
  Top Layer w0.254: v1(66.04,79.43) 65.11,79.43 Q4.3 ; R41.2 89.92,74.48 89.16,73.72 88.51,73.72 U1.25 87.25,73.2 v1(86.49,73.96)
  Bottom Layer w0.254: v1(66.04,79.43) 71.5,73.96 v1(86.49,73.96)
GPIO_1: length 71.3
  Top Layer w0.254: U1.35 88.09,86 93.07,86 95.09,83.99 95.09,71.65 93.35,69.91 50.79,69.91 50.29,70.41 50.29,72.82 50.55,73.08 51.38,73.08 51.56,72.9 51.56,72.36 U20.3
GPIO_3: length 64.9
  Top Layer w0.254: U20.2 50.93,70.28 50.94,70.27 93.21,70.27 94.73,71.79 94.73,83.63 94.11,84.25 88.37,84.25 U1.34
GPIO_4: length 86.5
  Top Layer w0.254: v1(82.98,86.3) 82.98,77.97 86.4,74.55 86.73,74.55 86.81,74.47 U1.26 ; v1(58.47,87.49) 58.4,87.42 47.41,87.42 46.33,88.5 40.15,88.5 39.75,88.09 39.75,86.75 40.46,86.04 40.46,85.27 41.53,84.19 42.3,84.19 42.55,83.95 42.55,76.57 42.72,76.39 42.72,75.71 42.25,75.23 39.58,75.23 36.91,72.57 34.67,72.57 34.42,72.31 U21.3 U21.2
  Bottom Layer w0.254: v1(58.47,87.49) 59.27,87.49 59.34,87.42 60.27,87.42 60.7,86.99 61.48,86.99 61.9,87.42 82.43,87.42 82.98,86.87 v1(82.98,86.3)
GPIO_12: length 19.5
  Top Layer w0.254: v1(70.99,71.17) 69.99,72.17 U1.14 ; Q3.1 84.01,68.32 v1(83.69,68.63)
  Bottom Layer w0.254: v1(83.69,68.63) 73.53,68.63 v1(70.99,71.17)
GPIO_14: length 31.3
  Top Layer w0.254: Q2.1 92.33,65.73 v1(92.33,67.36) ; v1(68.58,71.17) 68.58,73.06 68.67,73.14 68.67,73.79 68.83,73.95 69.48,73.95 U1.13
  Bottom Layer w0.254: v1(68.58,71.17) 72.39,67.36 v1(92.33,67.36)
GPIO_16: length 82.4
  Top Layer w0.254: v1(58.4,86.73) 57.84,86.73 57.53,87.04 47.25,87.04 46.18,88.11 40.31,88.11 40.13,87.94 40.13,86.91 40.81,86.23 40.81,85.42 41.68,84.55 42.49,84.55 42.93,84.11 42.93,76.72 43.11,76.54 43.11,75.55 42.4,74.85 39.74,74.85 37.07,72.19 35.94,72.19 35.69,71.93 U21.4 ; v1(83.67,85.27) 83.67,78.56 86.49,75.74 87.99,75.74 U1.27
  Bottom Layer w0.254: v1(58.4,86.73) 58.86,86.73 59.19,87.06 59.62,86.64 61.62,86.64 62.05,87.06 82.28,87.06 82.35,86.99 82.35,86.32 82.4,86.27 82.4,86.06 82.8,85.66 83.28,85.66 v1(83.67,85.27)
GPIO_17: length 85.7
  Top Layer w0.254: U1.28 86.69,77.01 84.25,79.45 v1(84.25,85.92) ; v1(58.47,88.25) 57.98,88.25 57.66,87.93 47.62,87.93 46.54,89 39.94,89 39.24,88.3 39.24,86.54 40.1,85.68 40.1,85.12 41.38,83.84 41.94,83.84 42.04,83.74 42.04,76.36 42.22,76.18 42.22,75.92 42.04,75.74 39.37,75.74 37.9,74.27 37.9,74.08 37.35,73.53 37.16,73.53 36.7,73.08 34.24,73.08 32.92,71.76 32.91,71.76 32.57,71.42 32.57,71.41 U21.1
  Bottom Layer w0.254: v1(84.25,85.92) 84.25,86.48 84,86.73 84,87.23 83.3,87.93 61.91,87.93 61.33,87.35 60.84,87.35 60.27,87.93 59.28,87.93 58.96,88.25 v1(58.47,88.25)
GPIO_19: length 55.4
  Top Layer w0.254: v1(96.14,78.66) 96.14,75.87 95.44,75.17 95.44,71.5 93.5,69.56 89.83,69.56 86.11,65.84 86.11,53.88 86.47,53.52 86.47,51.37 90.72,47.13 90.72,44.37 ; v1(89.79,78.66) 91.58,78.66 R21.1 89.65,80.82 U1.31
  Bottom Layer w0.254: v1(96.14,78.66) v1(89.79,78.66)
GPIO_21: length 71.7
  Top Layer w0.254: v1(76.45,48.56) 76.45,45.73 U17.4 ; U1.33 91.4,83.36 R17.1 90.84,82.09 v1(90.04,82.09)
  Bottom Layer w0.254: v1(90.04,82.09) 90.68,82.73 96.27,82.73 98.42,80.57 98.42,50.47 96.77,48.82 76.71,48.82 v1(76.45,48.56)
GPIO_22: length 86.5
  Top Layer w0.254: v1(70.99,47.68) 70.99,45.68 U17.5 ; v1(91.69,89.97) R18.1 88.01,87.16 U1.36 ; U5.5 84.84,44.84 v1(84.84,47.17)
  Bottom Layer w0.254: v1(70.99,47.68) 84.33,47.68 v1(84.84,47.17) 98.04,47.17 99.06,48.18 99.06,54.22 99.26,54.42 99.26,54.9 99.06,55.11 99.06,82.6 96.96,84.7 95.41,84.7 94.3,85.81 94.3,87.36 v1(91.69,89.97)
GPIO_25: length 21.1
  Top Layer w0.254: v1(59.94,67.87) 58.76,66.68 U3.14 ; U1.10 69.48,77.76 68.83,77.76 67.94,76.88 67.94,74.98 67.78,74.82 66.53,74.82 63.9,72.19 60.96,72.19 v1(59.82,71.04)
  Bottom Layer w0.254: v1(59.82,71.04) 59.82,68 v1(59.94,67.87)
GPIO_26: length 20
  Top Layer w0.254: U1.11 69.99,77.14 69.72,77.41 68.98,77.41 68.57,77 68.57,76.87 68.3,76.6 68.3,74.83 67.81,74.35 66.67,74.35 64.14,71.81 61.53,71.81 v1(60.71,70.98) ; v1(60.71,67.74) 59.41,66.45 U3.13
  Bottom Layer w0.254: v1(60.71,70.98) v1(60.71,67.74)
GPIO_27: length 20.1
  Top Layer w0.254: U1.12 69.48,75.22 68.83,75.22 68.67,75.06 68.67,74.7 65.14,71.17 v1(61.98,71.17) ; U3.15 58.17,64.83 v1(58.17,66.67)
  Bottom Layer w0.254: v1(58.17,66.67) 61.54,66.67 61.72,66.85 61.72,70.92 v1(61.98,71.17)
LINE_IN_L: length 72.8
  Top Layer w0.254: U13.1 25.81,26.92 R10.1 28.79,26.3 39.5,37.01 51.18,37.01 63.63,49.45 79.03,49.45 81.48,51.91 81.48,52.33 81.66,52.51 84.53,52.51
LINE_IN_R: length 85.5
  Top Layer w0.254: 17.56,28.19 17.49,28.12 16.74,28.12 ; R16.1 16.74,28.12 ; 16.74,28.12 v1(15.49,28.12) ; 78.03,52.51 80.9,52.51 81.08,52.33 81.08,52.08 78.86,49.86 63.46,49.86 51.01,37.41 39.33,37.41 29.94,28.02 v1(29.43,28.02)
  Bottom Layer w0.254: v1(29.43,28.02) 15.59,28.02 v1(15.49,28.12)
MIC_SIGNAL: length 83.7
  Top Layer w0.254: 90.72,40.56 86.7,36.55 83.94,36.55 ; U5.8 85.31,37.92 83.94,36.55 ; 83.94,36.55 47.77,36.55 47.14,35.93 47.14,14.44 45.71,13 R7.2 38.86,13.15 38.86,16.07
MIC_VOL_OUT_L: length 34.5
  Top Layer w0.254: U5.7 87.63,41.83 87.81,41.65 87.81,41.4 87.63,41.22 86.71,41.22 86.4,41.53 84.21,41.53 83.9,41.22 81.74,41.22 78.96,38.44 78.71,38.44 v1(78.31,38.04) ; R24.1 60.39,34.29 v1(72.16,34.29)
  Bottom Layer w0.254: v1(78.31,38.04) 77.92,37.65 77.92,37.4 74.89,34.37 72.73,34.37 72.65,34.29 v1(72.16,34.29)
MIC_VOL_OUT_R: length 34.5
  Top Layer w0.254: v1(72.16,32.77) 72.19,32.74 R22.1 ; v1(78.85,37.5) 79.25,37.9 79.25,38.15 79.86,38.76 80.12,38.76 80.89,37.99 81.14,37.99 81.97,38.81 81.97,39.07 81.19,39.84 81.19,40.1 81.91,40.81 84.07,40.81 84.38,41.13 86.23,41.13 86.54,40.81 87.8,40.81 88.21,41.23 88.21,41.65 88.39,41.83 90.72,41.83
  Bottom Layer w0.254: v1(72.16,32.77) 72.16,33.22 72.9,33.96 75.06,33.96 75.39,34.29 75.64,34.29 76.34,33.59 76.59,33.59 77.42,34.41 77.42,34.67 76.72,35.37 76.72,35.62 78.21,37.11 78.46,37.11 v1(78.85,37.5)
MIX_L_MUSIC: length 19.7
  Top Layer w0.254: 84.53,54.71 84.77,54.71 86.12,53.37 86.12,51.65 85.71,51.25 84.47,51.25 77.85,44.63 77.85,41.76 77.67,41.58 U17.1
MIX_R_MUSIC: length 30.8
  Top Layer w0.254: U17.8 74.62,41.58 75.19,42.14 77.04,42.14 77.44,42.55 77.44,44.8 84.31,51.66 85.55,51.66 85.71,51.82 85.71,53.2 85.55,53.37 83.51,53.37 83.02,52.87 81.52,52.87 81.31,52.66 81.25,52.66 81.04,52.87 79.87,52.87 78.03,54.71
MUSIC_VOL_OUT_L: length 38.3
  Top Layer w0.254: U17.2 74.68,42.85 73.53,43.99 v1(73.41,43.99) ; v1(72.14,35.05) 54.19,35.05 R25.2
  Bottom Layer w0.254: v1(73.41,43.99) 72.08,42.67 68.21,42.67 67.87,42.33 67.87,41.85 68.1,41.62 68.1,40.16 72.14,36.12 v1(72.14,35.05)
MUSIC_VOL_OUT_R: length 24.5
  Top Layer w0.254: v1(73.66,35.1) 82.99,35.1 R23.1 ; U17.7 70.59,42.96 69.32,42.96 v1(68.45,42.09)
  Bottom Layer w0.254: v1(68.45,42.09) 68.45,40.31 v1(73.66,35.1)
NET17: length 3.5
  Top Layer w0.254: C12.1 23.13,30.75 U13.4
RTS: length 12.6
  Top Layer w0.254: v1(52.2,79.04) U20.14 ; R36.1 v1(60.07,76.36)
  Bottom Layer w0.254: v1(60.07,76.36) 54.88,76.36 v1(52.2,79.04)
USB_DN: length 16.8
  Top Layer w0.254: USBC1.A7 54.49,85.4 54.74,85.65 55.23,85.65 55.42,85.46 55.42,84.77 USBC1.B7 55.49,83.79 55.44,83.75 55.44,79.42 56.57,78.3 56.57,76.65 55.44,75.52 55.44,72.46 56.01,71.9 U20.6
USB_DP: length 16.8
  Top Layer w0.254: USBC1.B6 54.06,84.63 54.06,83.93 54.22,83.77 54.75,83.77 54.92,83.93 54.92,84.63 USBC1.A6 54.99,83.79 55.03,83.75 55.03,82.78 54.85,82.6 54.58,82.6 54.4,82.42 54.4,81.26 54.58,81.08 54.85,81.08 55.03,80.9 55.03,78.75 55.3,78.49 55.3,76.65 55.03,76.39 55.03,72.19 54.74,71.9 U20.5
VG: length 206.6
  Top Layer w0.508: R28.1 76.45,21.91 v1(76.45,21.64) ; v1(28.58,23.29) 30.23,24.94 R4.1 30.55,24.76 30.55,22.34 C9.1 31.06,21.82 31.75,21.13 31.75,20.75 32.51,19.99 32.51,19.47 C8.2 33.41,18.57 42.86,18.57 C10.1 44.55,18.06 v1(46.1,19.61) ; R9.1 26.41,34.22 24.45,36.18 C12.2 22.43,36.88 v1(20.32,36.88) 17.74,36.88 R15.2 ; v1(51.82,20.37) 50.07,22.12 v1(48.61,22.12) ; v1(93.28,30.72) 91.23,30.72 C29.2 ; v1(17.65,19.99) 17.54,20.1 C11.1 ; v1(82.36,23.1) 82.36,21.72 C30.2 ; v1(82.36,23.1) 80.9,24.56 U14.4 ; v1(82.36,23.1) 83.82,24.56 U14.5 ; C33.2 67.69,30.91 v1(68.96,29.64) ; 20.03,73.69 20.03,75.39 R1.2 ; 20.03,73.69 R2.1 25.25,72.93 C6.1 ; 20.03,73.69 19.5,74.22 v1(18.16,74.22) ; R33.1 51.7,25.07 v1(49.91,25.07) ; U19.4 v1(59.82,23.67) U19.5 65.17,23.67 C34.2
  Inner2 w0.508: v1(17.65,19.99) 25.27,19.99 v1(28.58,23.29) 28.58,28.63 v1(20.32,36.88) 18.16,39.04 v1(18.16,74.22) ; v1(46.1,19.61) v1(48.61,22.12) 49.91,23.42 v1(49.91,25.07) ; v1(93.28,30.72) 85.66,23.1 v1(82.36,23.1) 80.47,21.21 76.89,21.21 v1(76.45,21.64) 76.45,22.15 v1(68.96,29.64) 65.79,29.64 v1(59.82,23.67) 56.52,20.37 v1(51.82,20.37)
XLR_OUT_L_COLD: length 14.5
  Top Layer w0.254: C36.2 68.46,16.9 65.35,13.8 65.35,12.7 65.53,12.52 66.11,12.52 66.29,12.34 66.29,11.18 66.11,11 65.53,11 65.35,10.82 65.35,8.61 U18.3
XLR_OUT_L_HOT: length 14.5
  Top Layer w0.254: C35.2 58.55,17.03 64.95,10.63 64.95,8.61 U18.2
XLR_OUT_R_COLD: length 14.1
  Top Layer w0.254: U16.3 84.91,8.36 84.91,9.75 85.09,9.93 85.67,9.93 85.85,10.11 85.85,11.27 85.67,11.45 85.09,11.45 84.91,11.63 84.91,13.54 87.76,16.39 C32.2
XLR_OUT_R_HOT: length 14.1
  Top Layer w0.254: U16.2 84.51,8.36 84.51,10.25 78.36,16.39 78.36,16.56
$1N5041: length 10.4
  Top Layer w0.254: R4.2 32.99,24.94 34.02,23.92 35.56,23.92 36.89,22.59 36.89,22.32 U12.3 37.59,23.99 R3.2
$1N5114: length 8.4
  Top Layer w0.254: 38.86,21.62 39.26,22.02 R5.2 41.37,22.84 R6.2
$1N5155: length 27.6
  Top Layer w0.254: C7.1 32.09,15.61 32.09,17.56 32.62,18.09 41.57,18.09 42.58,17.08 44.4,17.08 46.68,19.37 46.68,19.85 46.34,20.19 45.86,20.19 45.46,20.6 43.54,20.6 R6.1 42.51,21.62 U12.1
$1N5236: length 4.1
  Top Layer w0.254: U12.5 34.65,14.4 C7.2
$1N5340: length 9
  Top Layer w0.254: R7.1 37.59,13.88 U12.6 36.89,16.77 36.89,17.04 36.56,17.38 36.08,17.38 35.46,16.76 R8.1
$1N5451: length 2.3
  Top Layer w0.254: C8.1 R8.2
$1N5642: length 3.3
  Top Layer w0.254: C9.2 36.11,21.83 U12.4
$1N5727: length 110.7
  Top Layer w0.254: U8.2 42.18,8.55 42.18,8.97 47.5,14.29 47.5,35.78 47.92,36.2 92.53,36.2 93.47,37.13 93.47,45.28 93.29,45.46 91.88,45.46 91.7,45.64 91.7,46.8 91.88,46.98 93.29,46.98 93.47,47.16 93.47,48.33 93.29,48.51 91.95,48.51 91.77,48.69 91.77,49.85 91.95,50.03 93.29,50.03 93.47,50.21 93.47,51.38 93.29,51.56 91.88,51.56 91.7,51.74 91.7,52.9 91.88,53.08 93.29,53.08 93.47,53.26 93.47,55.55 arc(93.59,55.84) 93.88,55.96 93.91,55.99 93.91,56.6 94.09,56.78 RELAY2.7
$1N5749: length 132
  Top Layer w0.254: RELAY2.5 96.05,52.09 96.05,51.01 96.83,50.23 97.08,50.23 98.07,51.21 98.32,51.21 99.14,50.39 99.14,50.13 98.16,49.15 98.16,48.89 98.45,48.61 98.45,12.84 92.53,6.92 92.53,1.46 92.12,1.04 91.53,1.04 89.47,3.1 84.01,3.1 83.83,2.92 83.83,2.25 83.65,2.07 82.49,2.07 82.31,2.25 82.31,2.92 82.13,3.1 25.11,3.1 24.69,3.51 24.69,3.94 U10.2
$1N5761: length 110.9
  Top Layer w0.254: RELAY2.2 93.51,56.78 93.92,57.19 94.88,57.19 95.33,57.64 97.36,57.64 97.52,57.48 97.52,56.09 97.36,55.93 94.43,55.93 94.31,55.81 94.31,55.78 94.08,55.55 94.06,55.55 93.88,55.37 93.88,36.97 92.7,35.79 48.08,35.79 47.9,35.61 47.9,14.12 42.59,8.81 42.59,8.55 U8.3
$1N5833: length 78.4
  Top Layer w0.254: RELAY2.6 96.42,54.66 v1(97.79,54.66) ; R3.1 34.8,24.88 35.05,25.14 35.05,26.47 37.46,28.88 v1(37.85,28.88)
  Bottom Layer w0.254: v1(37.85,28.88) 38.06,28.88 38.62,28.32 40.72,28.32 62.86,50.47 88.71,50.47 89.42,51.18 90.81,51.18 93.61,53.98 93.61,54.41 93.87,54.66 v1(97.79,54.66)
$1N6041: length 22.3
  Top Layer w0.254: U9.2 8.45,16.08 8.7,16.08 12.11,19.48 12.68,19.48 12.86,19.66 12.86,21.21 13.04,21.39 14.2,21.39 14.38,21.21 14.38,19.66 14.56,19.48 17.33,19.48 17.41,19.41 17.89,19.41 17.97,19.48 20.03,19.48 20.21,19.66 R11.1
$1N6045: length 12.1
  Top Layer w0.254: R11.2 21.28,25.05 21.28,27.9 20.56,28.61 20.98,29.03 21.4,29.03 21.83,29.46 U13.3 24.33,29.46 25.54,30.67 R9.2
$1N6052: length 22.3
  Top Layer w0.254: R12.1 21.86,21.98 21.68,21.8 21.68,19.99 22.18,19.49 21.76,19.08 18.14,19.08 18.06,19 17.24,19 17.17,19.08 12.28,19.08 8.87,15.67 8.45,15.67 U9.3
$1N6056: length 9.4
  Top Layer w0.254: R12.2 21.68,25.05 21.68,28.06 21.81,28.19 U13.2 23.22,28.3 R10.2
$1N6179: length 9.6
  Top Layer w0.254: R13.1 13.48,36.43 13.31,36.43 10.61,33.73 8.32,33.73 U11.2
$1N6296: length 9.5
  Top Layer w0.254: R14.1 13.31,31.73 11.85,33.19 11.32,33.19 11.14,33.02 11.14,32.87 10.96,32.69 9.79,32.69 9.61,32.87 9.61,33.02 9.43,33.19 8.45,33.19 U11.3
$1N6300: length 9.3
  Top Layer w0.254: R14.2 17.13,29.73 17.4,29.46 ; 17.4,29.46 17.56,29.46 ; 17.4,29.46 15.57,29.46 13.61,27.51 R16.2
$1N6309: length 10
  Top Layer w0.254: R15.1 17.8,34.17 17.8,31.26 17.42,30.88 ; 17.42,30.88 16.08,32.22 14.64,32.22 13.61,33.25 R13.2 ; 17.42,30.88 17.56,30.73
$1N7688: length 9.5
  Top Layer w0.254: RELAY2.8 92.86,63.47 Q2.3 91.24,63.27 D2.1
$1N7799: length 7.5
  Top Layer w0.254: RELAY1.8 84.53,61.74 Q3.3 79.3,63.21 D1.1
$1N8702: length 6.4
  Top Layer w0.254: U3.4 56.62,58.84 56.62,56.83 54.88,55.09 C20.2
$1N8779: length 9.5
  Top Layer w0.254: C21.2 60.97,53.26 59.89,54.34 57.21,54.34 56.82,54.74 56.82,55.92 57.46,56.56 57.46,59.03
$1N8919: length 7.7
  Top Layer w0.254: U3.2 55.34,58.86 55.34,56.56 52.07,53.28 C24.2
$1N8923: length 10
  Top Layer w0.254: U3.3 56.16,56.87 53.09,53.8 53.09,51.76 C24.1
$1N11443: length 2.8
  Top Layer w0.254: C28.1 56.63,66.33 56.16,65.86 U3.18
$1N12418: length 2.8
  Top Layer w0.254: U14.3 77.23,25.83 R27.2
$1N12445: length 10
  Top Layer w0.254: R28.2 76.26,24.11 76.26,27.44 ; 76.26,27.44 76.6,27.1 U14.2 ; 76.26,27.44 R26.1
$1N12526: length 9.6
  Top Layer w0.254: R29.2 89.04,27.7 90.92,25.83 ; 90.92,25.83 R30.1 ; 90.92,25.83 90.82,25.83 89.73,24.74 87.31,24.74 86.22,25.83 U14.6
$1N12984: length 22.5
  Top Layer w0.254: R30.2 86.85,25.7 86.75,25.8 86.75,26.07 86.42,26.4 86.15,26.4 U14.7 83.72,27.1 81.75,25.13 78.94,25.13 78.6,24.8 78.6,21.99 77.92,21.31 77.92,21.06 C32.1
$1N13602: length 12.7
  Top Layer w0.254: R31.1 52.21,27.12 v1(52.07,26.97) ; v1(59.18,26.34) 57.04,26.34 U19.2 ; R33.2 v1(54.09,26.97)
  Bottom Layer w0.254: v1(52.07,26.97) v1(54.09,26.97) 58.55,26.97 v1(59.18,26.34)
$1N13611: length 23.4
  Top Layer w0.254: C35.1 54.71,18.7 54.96,18.7 55.98,17.68 56.23,17.68 56.72,18.17 56.72,18.53 55.81,19.44 55.81,19.8 56.01,20 56.01,20.25 55.52,20.75 55.52,21 56.34,21.83 56.59,21.83 57.09,21.33 57.34,21.33 57.96,21.95 57.96,22.2 57.47,22.69 55.78,22.69 55.21,23.27 55.21,26.5 56.19,27.48 U19.1 56.03,28.37 R31.2
$1N13618: length 10.2
  Top Layer w0.254: v1(59.18,25.07) 57.04,25.07 U19.3 ; v1(54.23,21.77) 54.23,23.18 R32.2
  Bottom Layer w0.254: v1(54.23,21.77) 55.88,21.77 v1(59.18,25.07)
$1N13634: length 23.2
  Top Layer w0.254: C36.1 58.37,21.82 58.37,22.62 57.88,23.1 55.95,23.1 55.62,23.44 55.62,23.91 55.96,24.26 60.42,24.26 61.16,24.99 61.16,25.18 61.5,25.52 61.68,25.52 61.79,25.63 62.04,25.63 62.46,26.04 U19.7 63.16,26.91 63.43,26.91 63.76,27.25 63.76,27.51 64.88,28.63 R35.2
$1N13638: length 6.8
  Top Layer w0.254: R35.1 67.42,28.02 R34.2 64.34,24.94 U19.6
$1N17594: length 6.9
  Top Layer w0.254: USBC1.A5 55.99,83.76 56.52,83.24 56.7,83.24 56.91,83.03 57.39,83.03 57.59,83.24 59.93,83.24 R38.2
$1N17598: length 3.6
  Top Layer w0.254: USBC1.B5 52.99,83.45 52.57,83.03 52.01,83.03 R39.2
$1N18129: length 3.6
  Top Layer w0.254: R36.2 64.05,76.31 Q5.1
$1N18189: length 3.1
  Top Layer w0.254: Q4.1 61.18,82.1 R37.2
$1N18988: length 2.8
  Top Layer w0.508: LED1.2 26.65,84.02 R42.1
$1N19092: length 16.4
  Top Layer w0.508: D3.2 4.95,80.19 10.53,85.76 U6.1
$1N40597: length 78.5
  Top Layer w0.254: R5.1 41.26,28.01 40.36,28.91 v1(38.86,28.91) ; RELAY2.3 v1(88.14,54.58)
  Bottom Layer w0.254: v1(38.86,28.91) 40.73,28.91 57.09,45.27 57.09,45.52 56.93,45.68 56.93,45.94 57.76,46.76 58.01,46.76 58.17,46.6 58.42,46.6 62.7,50.88 88.54,50.88 89.25,51.59 90.64,51.59 93.21,54.15 93.21,54.41 93.03,54.58 v1(88.14,54.58)
$1N40603: length 131.8
  Top Layer w0.254: U10.3 25.09,3.94 25.09,3.68 25.28,3.5 89.64,3.5 91.69,1.45 91.95,1.45 92.13,1.63 92.13,7.09 98.04,13 98.04,48.18 v1(95.63,50.6) ; RELAY2.4 89.66,52.21 v1(89.66,50.6)
  Bottom Layer w0.254: v1(95.63,50.6) v1(89.66,50.6)

## Copper pours and planes (outline as drawn; the poured copper is in the pictures)
GND on Top Layer: -28.19,98.22 106.93,98.22 106.93,-10.11 -28.19,-10.11
GND on Top Layer: -18.03,99.11 106.93,99.11 106.93,-13.28 -18.03,-13.28
GND on Bottom Layer: -28.32,103.68 113.79,103.68 113.79,-20.4 -28.32,-20.4
GND on Bottom Layer: -21.46,100.76 111.25,100.76 111.25,-13.67 -21.46,-13.67
GND on GND: 0.26,90.73 99.74,90.73 99.74,0.26 0.26,0.26

Small or netless copper shapes (teardrops, artwork), in the pictures only: 185 on GND

## Text on the board
Top Silkscreen Layer: LINE_IN_R | +12V | Mic Wireless | GND | Link to documentation on GitHub / https://github.com/amichayfrid-cell/Hall-control-mixer | L_OUT | R_OUT | LINE_IN_L | Mic Wired
